# Altium schematic sheet POWER_SWITCH.SchDoc
size A4; SheetNumber: 4; SheetTotal: 7
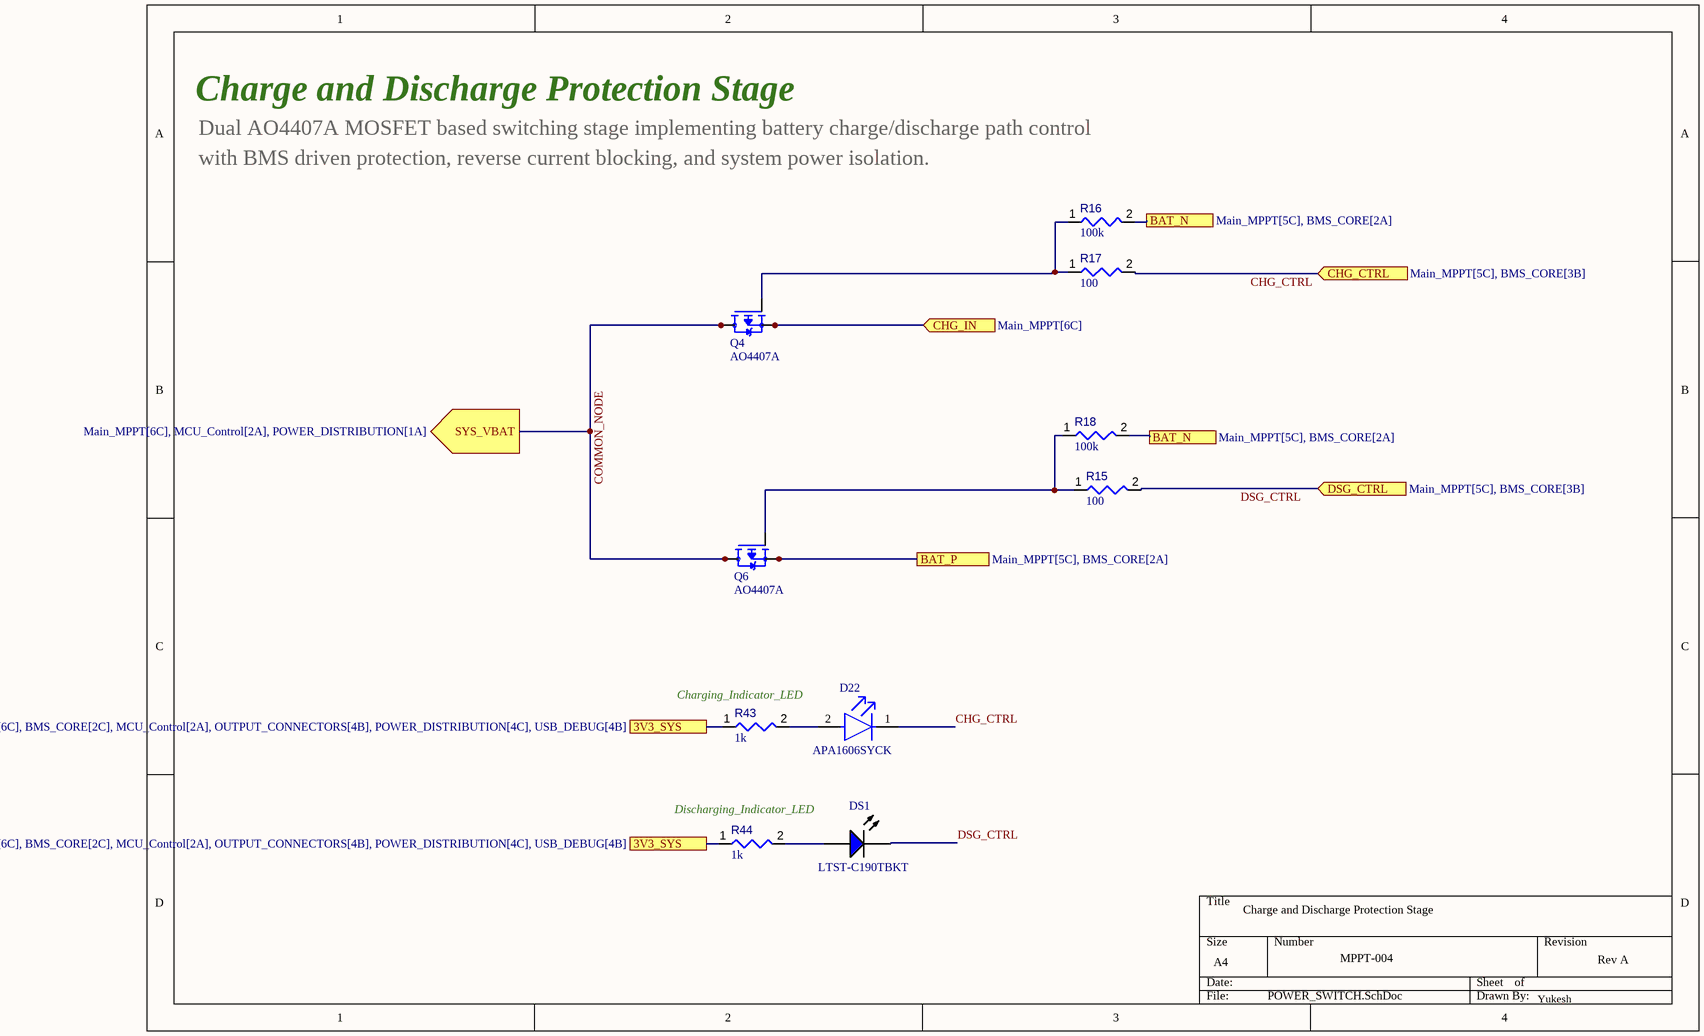
[diagram p0: POWER_SWITCH.SchDoc]

## Parts
D22  APA1606SYCK  [FP-APA1606SYCK-MFG]
DS1  LTST-C190TBKT  [LTST-C190TBKT-2_V]
Q4  AO4407A  [SOIC127P600X175-8N]
Q6  AO4407A  [SOIC127P600X175-8N]
R15  value 100  [RESC0402(1005)_L]  (hidden comment: 100R2F)
R16  value 100k  [RESC0402(1005)_L]  (hidden comment: 100KR2F)
R17  value 100  [RESC0402(1005)_L]  (hidden comment: 100R2F)
R18  value 100k  [RESC0402(1005)_L]  (hidden comment: 100KR2F)
R43  value 1k  [RESC0402(1005)_L]  (hidden comment: 1KR2J)
R44  value 1k  [RESC0402(1005)_L]  (hidden comment: 1KR2J)

## Ports
3V3_SYS (see Main_MPPT[6C], BMS_CORE[2C], MCU_Control[2A], OUTPUT_CONNECTORS[4B], POWER_DISTRIBUTION[4C], USB_DEBUG[4B]), BAT_N (see Main_MPPT[5C], BMS_CORE[2A]), BAT_P (see Main_MPPT[5C], BMS_CORE[2A]), CHG_CTRL (in, see Main_MPPT[5C], BMS_CORE[3B]), CHG_IN (in, see Main_MPPT[6C]), DSG_CTRL (in, see Main_MPPT[5C], BMS_CORE[3B]), SYS_VBAT (out, see Main_MPPT[6C], MCU_Control[2A], POWER_DISTRIBUTION[1A])

## Nets
3V3_SYS: R43.1 R44.1 ; port 3V3_SYS
BAT_N: R16.2 R18.2 ; port BAT_N
BAT_P: Q6.1(S) Q6.2(S) Q6.3(S) ; port BAT_P
CHG_CTRL: D22.1(C) R17.2 ; port CHG_CTRL
CHG_IN: Q4.1(S) Q4.2(S) Q4.3(S) ; port CHG_IN
COMMON_NODE: Q4.5(D) Q4.6(D) Q4.7(D) Q4.8(D) Q6.5(D) Q6.6(D) Q6.7(D) Q6.8(D) ; port SYS_VBAT
DSG_CTRL: DS1.2(K) R15.2 ; port DSG_CTRL
NetD22_2: D22.2(A) R43.2
NetDS1_1: DS1.1(A) R44.2
NetQ4_4: Q4.4(G) R16.1 R17.1
NetQ6_4: Q6.4(G) R15.1 R18.1

## Notes on the sheet
- Charge and Discharge Protection Stage
- Dual AO4407A MOSFET based switching stage implementing battery charge/discharge path control
- (near R16) with BMS driven protection, reverse current blocking, and system power isolation.
- (near R43) Charging_Indicator_LED
- Discharging_Indicator_LED
- MPPT-004
- Rev A
- Yukesh

## Library data of the parts
D22 = CMP-44529-000039-1: LED YELLOW CLEAR CHIP SMD R/A; Forward Current: 20mA; Luminous Intensity: 150mcd; Power Rating: 75mW; Viewing Angle: 110°; Dominant Wavelength: 590nm; Number of LEDs: 1; Forward Voltage: 2V; Case/Package: SMD/SMT; Min Operating Temperature: -40°C; Lead Free: Lead Free; Number of Pins: 2; Package Quantity: 2000; Packaging: Tape and Reel; Mount: Surface Mount; Illumination Color: Yellow; Width: 1.2mm; Lens Style: Clear; Lens Color: Clear; Height: 0.6mm; Length: 1.6mm; Max Operating Temperature: 85°C; Color: Yellow; Test Current: 20mA
DS1 = CMP-1674-00010-1: Single Color Chip LED, 2.8 to 3.8 V, 28 to 180 mcd, -20 to 80 degC, 2-Pin SMD, RoHS, Tape and Reel; Nominal Supply Voltage: 3 V; Min Supply Voltage: 2.1 V; Interface: Serial; Case\Package: DFN; Max Supply Voltage: 3.6 V; Min Operating Temperature: -40 degC; ComponentLink2URL: http://optoelectronics.liteon.com/upload/download/DS-22-99-0224/S_110_LTST-C190TBKT(0630).pdf; Length: 3 mm; PackageReference: C190TBKT-2; Packaging: Cut Tape; RoHSCompliant: true; DatasheetVersion: Rev. K, 08/2011; Width: 3 mm; Pins: 6; Height: 1.1 mm; Max Operating Temperature: 125 degC; Mount: Surface Mount; PackageDescription: 2-Pin Surface Mount Device, Body 1.6 x 0.8 mm; ComponentLink1Description: Manufacturer URL; ComponentLink1URL: http://www.us.liteon.com/; REACH SVHC: No SVHC; ComponentLink2Description: Datasheet
Q4 Q6 = CMP-058-000000-1: P-Channel 30 V 12A (Ta) 3.1W (Ta) Surface Mount 8-SOIC; MF: Alpha &; Value: IC; Package: SOIC-8 Alpha &amp; Omega Semiconductor; Check_prices: https://www.snapeda.com/parts/AO4407A/Alpha/view-part/?ref=eda; Design Item ID: AO4407A; Component Type: Standard; Source: AO4407A.SchLib; Pin Count: 8; MP: AO4407A; SnapEDA_Link: https://www.snapeda.com/parts/AO4407A/Alpha/view-part/?ref=snap
R15 R17 = CMP-009-00065-2: 100R 0.063W 1% 0402 (1005 Metric)  SMD; Power: 63mW; Tolerance: 1%; Case/Package: 0402; Pins: 2; Mounting Technology: SMT
R16 R18 = CMP-009-00064-2: 100K 0.063W 1% 0402 (1005 Metric)  SMD; Power: 63mW; Case/Package: 0402; Mounting Technology: SMT; Pins: 2; Tolerance: 1%
R43 R44 = CMP-009-00075-2: 1K 0.063W 5% 0402 (1005 Metric)  SMD; Power: 63mW; Pins: 2; Mounting Technology: SMT; Case/Package: 0402; Tolerance: 5%